# Altium project uADC_USB.PrjPcb
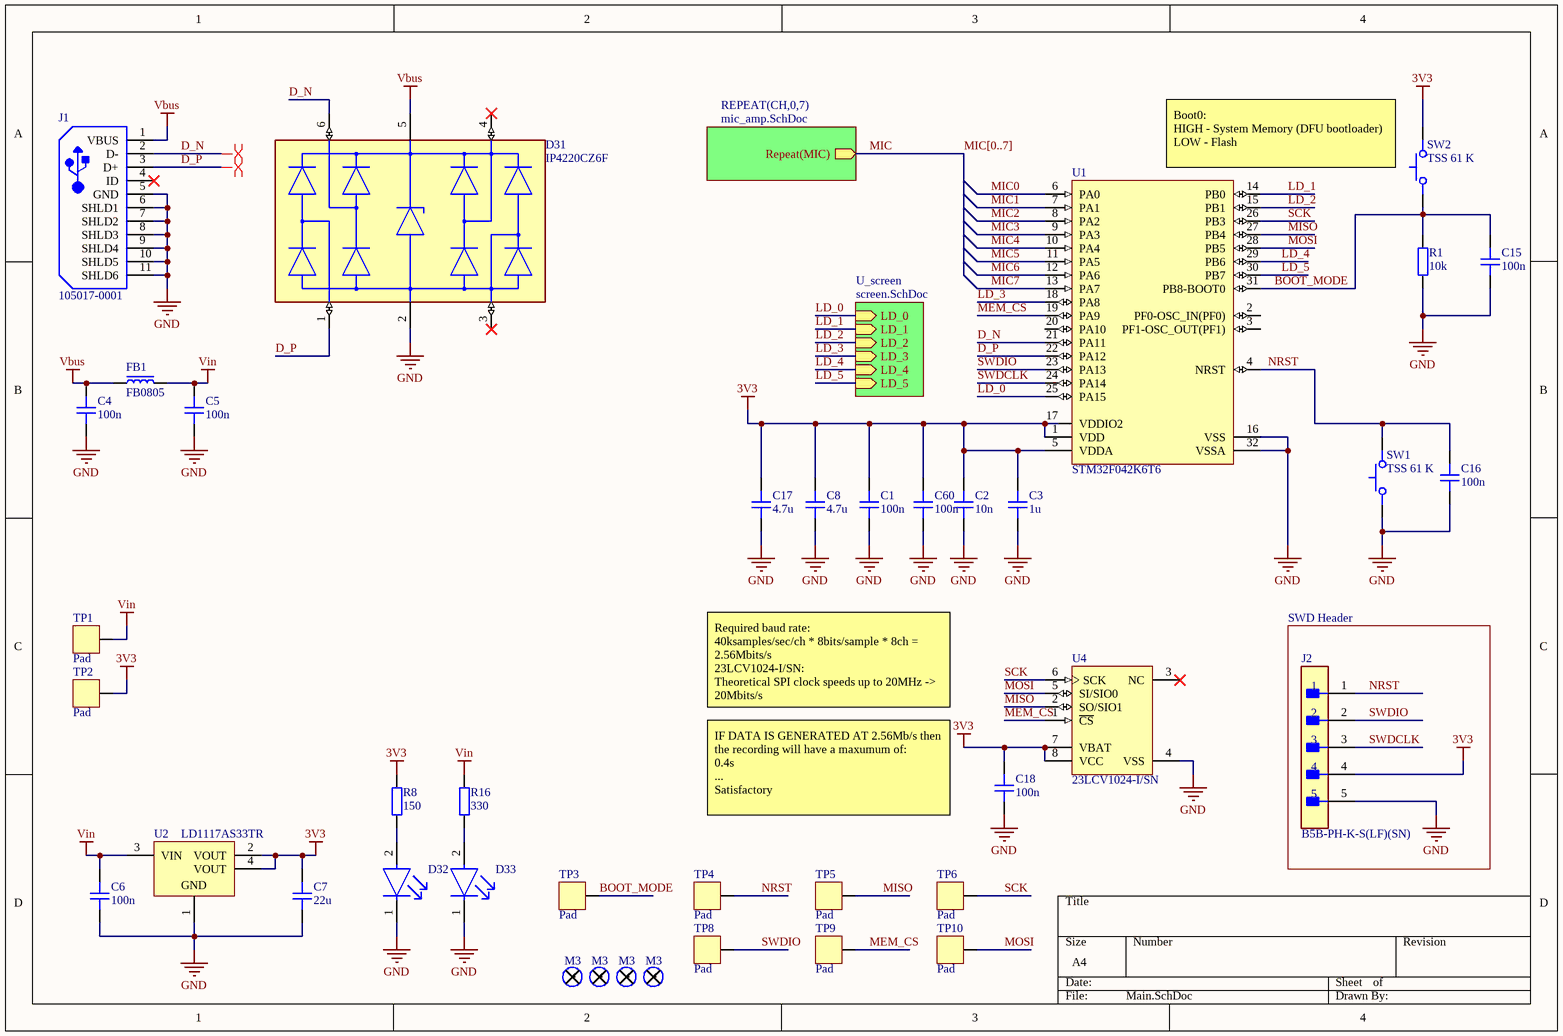
[diagram p0: Main.SchDoc]
3 sheets, 250 parts. Net scope: hierarchical (ports join the sheet entries above them; power ports are global).
Board file: uADC_PCBPcbDoc.PcbDoc
Sheets:
  Main.SchDoc
    U_screen = screen.SchDoc
    CH0 = mic_amp.SchDoc
    CH1 = mic_amp.SchDoc
    CH2 = mic_amp.SchDoc
    CH3 = mic_amp.SchDoc
    CH4 = mic_amp.SchDoc
    CH5 = mic_amp.SchDoc
    CH6 = mic_amp.SchDoc
    CH7 = mic_amp.SchDoc

## Sheet Main.SchDoc
size A4; SheetNumber: 1; SheetTotal: 3

### Parts
(Parts that share a designator on the sheet are numbered #1, #2 ... from top to bottom, then left to right.)
*1  M3Hole  [M3_Hole]  (value not drawn)  (no BOM)
*2  M3Hole  [M3_Hole]  (value not drawn)  (no BOM)
*3  M3Hole  [M3_Hole]  (value not drawn)  (no BOM)
*4  M3Hole  [M3_Hole]  (value not drawn)  (no BOM)
C1  100n  [CAP_0603]
C2  10n  [CAP_0603]
C3  1u  [CAP_0603]
C4  100n  [CAP_0603]
C5  100n  [CAP_0603]
C6  100n  [CAP_0603]
C7  22u  [CAP_0603]
C8  4.7u  [CAP_0603]
C15#1  100n  [CAP_0603]
C16#1  100n  [CAP_0603]
C17#1  4.7u  [CAP_0603]
C18#1  100n  [CAP_0603]
C60#1  100n  [CAP_0603]
D31  IP4220CZ6F  [FP-SOT457-IPC_A]
D32  598-8270-107F  [FP-598-8270-107F-MFG]  (value not drawn)
D33  598-8270-107F  [FP-598-8270-107F-MFG]  (value not drawn)
FB1  FB0805  [FB_0805]
J1  105017-0001  [USB-MICRO-B_V]
J2  B5B-PH-K-S(LF)(SN)  [FP-B5B-PH-K-S_LF_SN-MFG]
R1  10k  [RES_0603]
R8#1  150  [RES_0603]
R16#1  330  [RES_0603]
SW1  TSS 61 K  [Generic SMD Tactile switch]
SW2  TSS 61 K  [Generic SMD Tactile switch]
TP1  Pad  [PAD_SQ_2MM]  (no BOM)
TP2  Pad  [PAD_SQ_2MM]  (no BOM)
TP3  Pad  [PAD_SQ_2MM]  (no BOM)
TP4  Pad  [PAD_SQ_2MM]  (no BOM)
TP5  Pad  [PAD_SQ_2MM]  (no BOM)
TP6  Pad  [PAD_SQ_2MM]  (no BOM)
TP8  Pad  [PAD_SQ_2MM]  (no BOM)
TP9  Pad  [PAD_SQ_2MM]  (no BOM)
TP10#1  Pad  [PAD_SQ_2MM]  (no BOM)
U1  STM32F042K6T6  [STM-LQFP32_M]
U2  LD1117AS33TR  [SOT-223_M]
U4#1  23LCV1024-I/SN  [MCHP-SOIC-SN8_L]

### Blocks framed on the sheet
SWD Header: J2

### Sub-sheets
REPEAT(CH,0,7) = mic_amp.SchDoc: Repeat(MIC) (out)
U_screen = screen.SchDoc: LD_5 (in), LD_4 (in), LD_3 (in), LD_2 (in), LD_1 (in), LD_0 (in)

### Nets
3V3: C1.2 C2.2 C3.2 C7.2 C8.2 C17#1.2 C18#1.2 C60#1.2 J2.4 R8#1.2 SW2.2 TP2.1 U1.1(VDD) U1.5(VDDA) U1.17(VDDIO2) U2.2(VOUT) U2.4(VOUT) U4#1.7(VBAT) U4#1.8(VCC)
GND: C1.1 C2.1 C3.1 C4.1 C5.1 C6.1 C7.1 C8.1 C15#1.1 C16#1.1 C17#1.1 C18#1.1 C60#1.1 D31.2(GND) D32.1(C) D33.1(C) J1.5(GND) J1.6(SHLD1) J1.7(SHLD2) J1.8(SHLD3) J1.9(SHLD4) J1.10(SHLD5) J1.11(SHLD6) J2.5 R1.1 SW1.1 U1.16(VSS) U1.32(VSSA) U2.1(GND) U4#1.4(VSS)
Vbus: C4.2 D31.5(VP) FB1.1 J1.1(VBUS)
Vin: C5.2 C6.2 FB1.2 R16#1.2 TP1.1 U2.3(VIN)
BOOT_MODE: C15#1.2 R1.2 SW2.1 TP3.1 U1.31(PB8-BOOT0)
D_N: D31.6(I/O4) J1.2(D-) U1.21(PA11)
D_P: D31.1(I/O1) J1.3(D+) U1.22(PA12)
LD_0: U1.25(PA15) ; sheet U_screen/LD_0
LD_1: U1.14(PB0) ; sheet U_screen/LD_1
LD_2: U1.15(PB1) ; sheet U_screen/LD_2
LD_3: U1.18(PA8) ; sheet U_screen/LD_3
LD_4: U1.29(PB6) ; sheet U_screen/LD_4
LD_5: U1.30(PB7) ; sheet U_screen/LD_5
MEM_CS: TP9.1 U1.19(PA9) U4#1.1(~{CS})
MIC: sheet REPEAT(CH,0,7)/Repeat(MIC)
MIC0: U1.6(PA0)
MIC1: U1.7(PA1)
MIC2: U1.8(PA2)
MIC3: U1.9(PA3)
MIC4: U1.10(PA4)
MIC5: U1.11(PA5)
MIC6: U1.12(PA6)
MIC7: U1.13(PA7)
MISO: TP5.1 U1.27(PB4) U4#1.2(SO/SIO1)
MOSI: TP10#1.1 U1.28(PB5) U4#1.5(SI/SIO0)
NRST: C16#1.2 J2.1 SW1.2 TP4.1 U1.4(NRST)
SCK: TP6.1 U1.26(PB3) U4#1.6(SCK)
SWDCLK: J2.3 U1.24(PA14)
SWDIO: J2.2 TP8.1 U1.23(PA13)
NetD32_2: D32.2(A) R8#1.1
NetD33_2: D33.2(A) R16#1.1

Not connected (* = marked no-connect by the designer): *1 0; *2 0; *3 0; *4 0; D31 3(I/O2)* 4(I/O3)*; J1 4(ID)*; U1 2(PF0-OSC_IN(PF0)) 3(PF1-OSC_OUT(PF1)) 20(PA10); U4#1 3(NC)*

### Buses and harness runs
bus MIC[0..7]

### Layout directives
differential pair; rule Impedance Constraint [Min = 80.00    Max = 100.0    ]; rule Length Constraint [Min Length = 0mil    Max Length = 3937.008mil]: D_N
differential pair: D_P

### Notes on the sheet
- Boot0:
  HIGH - System Memory (DFU bootloader)
  LOW - Flash
- Required baud rate:
  40ksamples/sec/ch * 8bits/sample * 8ch = 2.56Mbits/s
  23LCV1024-I/SN:
  Theoretical SPI clock speeds up to 20MHz -> 20Mbits/s
- IF DATA IS GENERATED AT 2.56Mb/s then the recording will have a maxumum of:
  0.4s
  ...
  Satisfactory
- (in symbol M3Hole) M3

### Library data of the parts
C1-C8 C15#1 C16#1 C17#1 C18#1 C60#1 = CAP_0603: Capacitor SMD 0603, X7R, 10V; Manufacturer: *; Manufacturer Part Number: *; Distributor Link: *; LCSC: *; Rating: *; Dielectric: *
D31 = CMP-14432-000004-1: TVS DIODE 5.5VWM 6TSOP; RoHS Compliant: Yes
D32 D33 = CMP-15384-000006-1: SM LED 1206 ALINGAP G 7 REEL; Reverse Voltage: 5V; Viewing Angle: 140°; Power Dissipation: 60mW; Number of Elements: 1; Luminous Intensity: 20mcd; Color: Green; Lens Size: 1.6mm; Dominant Wavelength: 570nm; Test Current: 20mA; Forward Voltage: 2V; Lens Color: Colorless; Lens Transparency: Clear; Lens Style: Flat; Case/Package: 1206; RoHS Compliant: Yes; Number of Pins: 2; Packaging: Tape and Reel; Case Code (Metric): 3216; Lead Free: Lead Free; REACH SVHC: No SVHC; Height: 0.7mm; Depth: 1.6mm; Radiation Hardening: No; Length: 3.2mm; Wavelength: 570nm; Illumination Color: Green; Max Operating Temperature: 85°C; Min Operating Temperature: -30°C; Case Code (Imperial): 1206; Series: 598; Package Quantity: 3000; Mount: Surface Mount; Number of LEDs: 1; Forward Current: 20mA; Width: 1.6mm
FB1 = FB_0805: Ferrite Bead SMD 0805; Manufacturer: *; Manufacturer Part Number: *; Distributor Link: *; LCSC: *
J1 = CMP-2000-05827-1: Micro-USB B Receptacle, Right Angle, Bottom Mount, Surface Mount, with Solder Tabs, -30 to 85 degC, 5-Pin USB, RoHS, Tape and Reel; Manufacturer: Molex; Featured Product: Micro-USBConnectorsUSBConnectors; Other Names: WM1399DKR; Package Version: Rev. F, 12/2012; Number of Contacts: 5; Connector Type: USB-microB; Catalog Drawings: 1050170001; 3D Model: 105017-0001.stp; Mating Products: WM17145-ND-CABLEMICROUSBBTOSTDA1.0MWM17147-ND-CABLEMICROUSBBTOSTDA2.0MWM17146-ND-CABLEMICROUSBBTOSTDA1.5M; PCN Assembly/Origin: ResinSupplier21/Oct/2015; Voltage - Max: 30V; Online Catalog: Molex-MicroUSB; Manufacturer URL: http://www.molex.com/; Package Description: 5-Leads USB, Micro B, Body 7.5 x 5 mm, Pitch 0.65 mm; Datasheet URL: http://www.molex.com/elqNow/elqRedir.htm?ref=http://www.molex.com/webdocs/datasheets/pdf/en-us/1050170001_IO_CONNECTORS.pdf; Ingress Protection: -; Datasheet Version: 03/2016; Mounting Type: BoardCutout,SurfaceMount,RightAngle; Circuits: 5; Standard Package: 1; Package Reference: MICRO-B; Package URL: http://www.molex.com/pdm_docs/sd/1050170001_sd.pdf; Category: Connectors,Interconnects; Series: -; RoHS Information: 1050170001CertofCompliance; Features: Shielded,SolderRetention; Family: USB,DVI,HDMIConnectors; Specifications: -; Gender: Receptacle; Packaging: Digi-Reel®; Mounting Technology: SurfaceMount
J2 = CMP-2000-05908-2: CONN HEADER VERT 5POS 2MM; Voltage Rating (AC): 100V; Number of Positions: 5; Contact Resistance: 20mR; Insulation Resistance: 1MR; Current Rating: 2A; Gender: Male; Mated Stacking Heights: 8mm; Series: PH; Number of Poles: 5; Width: 4.5mm; Insulation Color: Natural; Fastening Type: Detent; Flammability Rating: UL94 V-0; Mount: Through Hole; Lead Free: Lead Free; Number of Rows: 1; REACH SVHC: No SVHC; Max Voltage Rating (AC): 100V; Contact Mating Length: 0.13inch; Contact Plating: Tin; Housing Material: Polyamide; Depth: 4.5mm; Contact Type: Male Pin; Voltage Rating: 100V; Color: Natural; Housing Color: White; Lead Pitch: 2mm; Number of Contacts: 5; Orientation: Straight; Packaging: Bulk; Contact Material: Brass; Pitch: 2mm; Insulation Material: Nylon; Connector Type: Header; Contact Finish - Mating: TIN; Termination: Solder; Number of Pins: 5; Length: 11.9mm; Contact Shape: Square; Max Current Rating: 2A; Working Voltage: 100V; Min Operating Temperature: -25°C; Max Operating Temperature: 85°C; Material: Polyamide; Height: 9.4mm
R1 R8#1 R16#1 = RES_0603: Resistor SMD 0603; Manufacturer: *; Manufacturer Part Number: *; Distributor Link: *; LCSC: *
SW1 SW2 = TSS 61 K: Keypad Switch, 1 Switches, SPST, Momentary, 0.05A, 12VDC, 1.47N, Solder Terminal, Surface Mount-straight; pin to pad: 1>1+2 2>3+4; Manufacturer: Knitter-Switch; Manufacturer Part Number: TSS61K; End Contact Plating: Silver; End Contact Material: Bronze; Actuator Type: STEM; Circuit Configuration: 1X1; Contact Current(DC)-Max: 50mA; Contact DC Max Rating R Load: .05A@12VDC; Contact Resistance: 0.1mR; Contact Voltage(DC)-Max: 12V; Dielectric Withstand Volts: 250VACV; Electrical Life: 200000Cycles; Insulation Resistance: 100MR; Number of Switches: 1; Solderability: REFLOW; Actuator Length: 0.031inch; Body Breadth: 6.2inch; Body Height: 3.5mm; Body Length or Diameter: 6.2mm; Supplier: TME; Supplier Part Number: TSS61K; RoHS: Yes; Category: Tactile Switches; Stock: 975; Mounting Technology: Surface Mount; Contact Material: Bronze; Center Contact Plating: Silver; Housing Material: Stainless Steel; Terminal Finish: Silver; Terminal Material: Brass; Min Operating Temperature: -40°C; Max Operating Temperature: 85°C; JESD-609 Code: e4; Operating Force-Max: 1.47N; Switch Action: MOMENTARY; Switch Function: SPST; Switch Type: Keypad; Termination: Solder; Reach SVHC Compliant: Yes; RoHS Compliant: Yes; ComponentLink1URL: https://datasheet.ciiva.com:443/pdfs/VipMasterIC/IC/KNSW/KNSW-S-A0003711307/KNSW-S-A0003711307-1.pdf?src-supplier=IHS+Markit; ComponentLink1Description: https://datasheet.ciiva.com:443/pdfs/VipMasterIC/IC/KNSW/KNSW-S-A0003711307/KNSW-S-A0003711307-1.pdf?src-supplier=IHS+Markit; ComponentLink2URL: http://www.knitter-switch.com/pdf_en/3_6_3%20TSS%20TS%20TMSE.pdf?src-supplier=Avnet; ComponentLink2Description: http://www.knitter-switch.com/pdf_en/3_6_3%20TSS%20TS%20TMSE.pdf?src-supplier=Avnet
TP1-TP6 TP8 TP9 TP10#1 = PAD_SQ_2MM: Test Point Square 2mm
U1 = CMP-0304-00114-2: ARM Cortex-M0 32-bit MCU, 32 KB Flash, 6 KB Internal RAM, 28 I/Os, 32-Pin LQFP, -40 to 85 degC, Tray; Manufacturer: STMicroelectronics; Operating Frequency(F) (Processor speed) (MHz): 48; Internal RAM Size (kB): 6; Supply Voltage(Vcc) min (V): 2; I/Os (High Current): 28; FLASH Size (Prog) (kB): 32; ComponentLink1Description: Manufacturer URL; Package Reference: LQFP32; ComponentLink2Description: Datasheet; ComponentLink1URL: http://www.st.com/; Core: ARM Cortex-M0; DatasheetVersion: Rev. 5; ComponentLink2URL: http://www.st.com/st-web-ui/static/active/en/resource/technical/document/datasheet/DM00105814.pdf; Packing: Tray; Package Description: 32-Pin Low Profile Quad Flat Package, 7 x 7 mm Body, 0.8 mm Pitch; PartNumber: STM32F042K6T6; Mounting Technology: Surface Mount
U2 = CMP-0244-00316-1: 1A, Low Drop Positive Voltage Regulator, 3.3V, 4-Pin SOT-223, Tape and Reel; ComponentLink1Description: Manufacturer URL; DatasheetVersion: 2/12/2011; PackageVersion: 2010; ComponentLink1URL: http://www.st.com; ComponentLink2Description: Datasheet; ComponentLink2URL: http://www.st.com/internet/com/TECHNICAL_RESOURCES/TECHNICAL_LITERATURE/DATASHEET/CD00002116.pdf; PackageDescription: 4-Pin SOT-223 Package, 6.5 x 3.5 mm Body, 2.3 mm Pitch, 7 mm Lead Span; PackageReference: SOT-223
U4#1 = CMP-0163-00037-1: 1024K bits SPI Serial SRAM with Battery Backup and SDI Interface, 2.5 to 5.5 V, 20 MHz, -40 to 85 degC, 8-pin SOIC (SN8), Tube; Manufacturer: Microchip; DatasheetVersion: Rev. A; ComponentLink3Description: Package Specification; PackageReference: SOIC-SN8; Mounting Technology: Surface Mount; PartNumber: 23LCV1024-I/SN; ComponentLink4Description: Product URL; ComponentLink2Description: Datasheet; ComponentLink3URL: http://www.microchip.com/stellent/groups/techpub_sg/documents/packagingspec/en012702.pdf; PackageDescription: 8-Lead Plastic Small Outline, 4.9 x 3.9 mm Body, 1.27 mm Pitch; ComponentLink1Description: Manufacturer URL; ComponentLink2URL: http://ww1.microchip.com/downloads/en/DeviceDoc/25156A.pdf; ComponentLink4URL: http://www.microchip.com/23LCV1024; ComponentLink1URL: http://www.microchip.com; PackageVersion: C04-057C

## Sheet screen.SchDoc
size A4; SheetNumber: 3; SheetTotal: 3
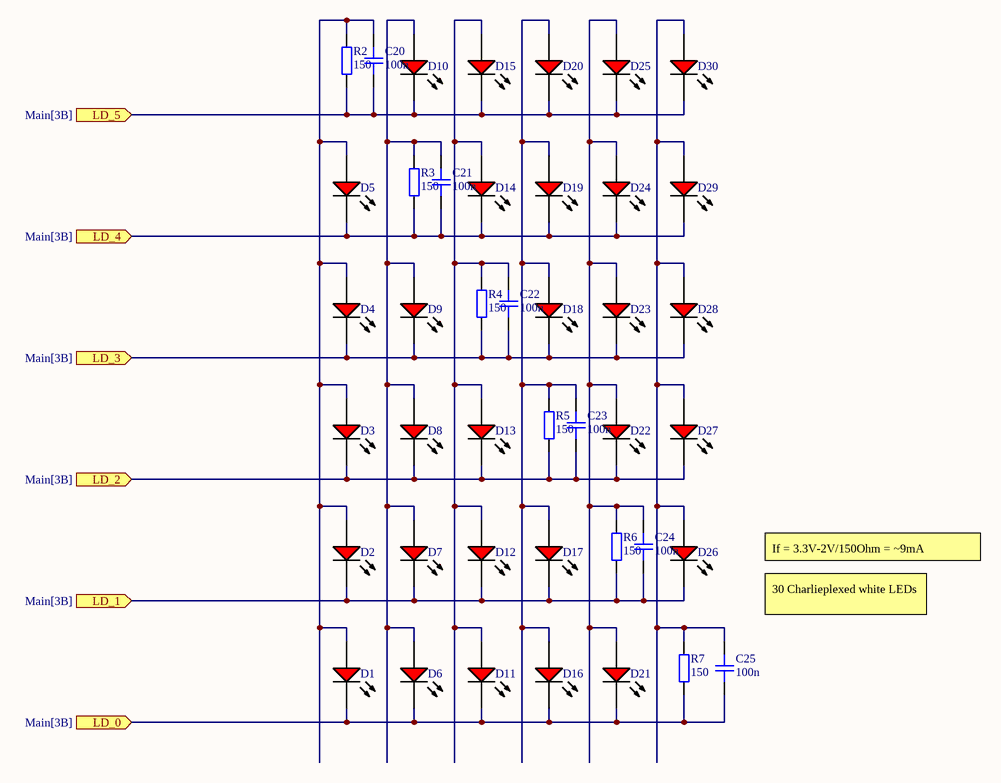
[diagram p1: screen.SchDoc]

### Parts
(Parts that share a designator on the sheet are numbered #1, #2 ... from top to bottom, then left to right.)
C20#1  100n  [CAP_0603]
C21#1  100n  [CAP_0603]
C22#1  100n  [CAP_0603]
C23#1  100n  [CAP_0603]
C24#1  100n  [CAP_0603]
C25#1  100n  [CAP_0603]
D1  SML-LX1206IC-TR  [LUMX-SML-LX1206IC_V]  (value not drawn)
D2  SML-LX1206IC-TR  [LUMX-SML-LX1206IC_V]  (value not drawn)
D3  SML-LX1206IC-TR  [LUMX-SML-LX1206IC_V]  (value not drawn)
D4  SML-LX1206IC-TR  [LUMX-SML-LX1206IC_V]  (value not drawn)
D5  SML-LX1206IC-TR  [LUMX-SML-LX1206IC_V]  (value not drawn)
D6  SML-LX1206IC-TR  [LUMX-SML-LX1206IC_V]  (value not drawn)
D7  SML-LX1206IC-TR  [LUMX-SML-LX1206IC_V]  (value not drawn)
D8  SML-LX1206IC-TR  [LUMX-SML-LX1206IC_V]  (value not drawn)
D9  SML-LX1206IC-TR  [LUMX-SML-LX1206IC_V]  (value not drawn)
D10  SML-LX1206IC-TR  [LUMX-SML-LX1206IC_V]  (value not drawn)
D11  SML-LX1206IC-TR  [LUMX-SML-LX1206IC_V]  (value not drawn)
D12  SML-LX1206IC-TR  [LUMX-SML-LX1206IC_V]  (value not drawn)
D13  SML-LX1206IC-TR  [LUMX-SML-LX1206IC_V]  (value not drawn)
D14  SML-LX1206IC-TR  [LUMX-SML-LX1206IC_V]  (value not drawn)
D15  SML-LX1206IC-TR  [LUMX-SML-LX1206IC_V]  (value not drawn)
D16  SML-LX1206IC-TR  [LUMX-SML-LX1206IC_V]  (value not drawn)
D17  SML-LX1206IC-TR  [LUMX-SML-LX1206IC_V]  (value not drawn)
D18  SML-LX1206IC-TR  [LUMX-SML-LX1206IC_V]  (value not drawn)
D19  SML-LX1206IC-TR  [LUMX-SML-LX1206IC_V]  (value not drawn)
D20  SML-LX1206IC-TR  [LUMX-SML-LX1206IC_V]  (value not drawn)
D21  SML-LX1206IC-TR  [LUMX-SML-LX1206IC_V]  (value not drawn)
D22  SML-LX1206IC-TR  [LUMX-SML-LX1206IC_V]  (value not drawn)
D23  SML-LX1206IC-TR  [LUMX-SML-LX1206IC_V]  (value not drawn)
D24  SML-LX1206IC-TR  [LUMX-SML-LX1206IC_V]  (value not drawn)
D25  SML-LX1206IC-TR  [LUMX-SML-LX1206IC_V]  (value not drawn)
D26  SML-LX1206IC-TR  [LUMX-SML-LX1206IC_V]  (value not drawn)
D27  SML-LX1206IC-TR  [LUMX-SML-LX1206IC_V]  (value not drawn)
D28  SML-LX1206IC-TR  [LUMX-SML-LX1206IC_V]  (value not drawn)
D29  SML-LX1206IC-TR  [LUMX-SML-LX1206IC_V]  (value not drawn)
D30  SML-LX1206IC-TR  [LUMX-SML-LX1206IC_V]  (value not drawn)
R2  150  [RES_0603]
R3  150  [RES_0603]
R4#1  150  [RES_0603]
R5#1  150  [RES_0603]
R6#1  150  [RES_0603]
R7#1  150  [RES_0603]

### Ports
LD_0 (in, see Main[3B]), LD_1 (in, see Main[3B]), LD_2 (in, see Main[3B]), LD_3 (in, see Main[3B]), LD_4 (in, see Main[3B]), LD_5 (in, see Main[3B])

### Nets
LD_0: C25#1.2 D1.2(K) D6.2(K) D11.2(K) D16.2(K) D21.2(K) R7#1.1 ; port LD_0
LD_1: C24#1.2 D2.2(K) D7.2(K) D12.2(K) D17.2(K) D26.2(K) R6#1.1 ; port LD_1
LD_2: C23#1.2 D3.2(K) D8.2(K) D13.2(K) D22.2(K) D27.2(K) R5#1.1 ; port LD_2
LD_3: C22#1.2 D4.2(K) D9.2(K) D18.2(K) D23.2(K) D28.2(K) R4#1.1 ; port LD_3
LD_4: C21#1.2 D5.2(K) D14.2(K) D19.2(K) D24.2(K) D29.2(K) R3.1 ; port LD_4
LD_5: C20#1.2 D10.2(K) D15.2(K) D20.2(K) D25.2(K) D30.2(K) R2.1 ; port LD_5
NetC20#1_1: C20#1.1 D1.1(A) D2.1(A) D3.1(A) D4.1(A) D5.1(A) R2.2
NetC21#1_1: C21#1.1 D6.1(A) D7.1(A) D8.1(A) D9.1(A) D10.1(A) R3.2
NetC22#1_1: C22#1.1 D11.1(A) D12.1(A) D13.1(A) D14.1(A) D15.1(A) R4#1.2
NetC23#1_1: C23#1.1 D16.1(A) D17.1(A) D18.1(A) D19.1(A) D20.1(A) R5#1.2
NetC24#1_1: C24#1.1 D21.1(A) D22.1(A) D23.1(A) D24.1(A) D25.1(A) R6#1.2
NetC25#1_1: C25#1.1 D26.1(A) D27.1(A) D28.1(A) D29.1(A) D30.1(A) R7#1.2

### Notes on the sheet
- If = 3.3V-2V/150Ohm = ~9mA
- 30 Charlieplexed white LEDs

### Library data of the parts
C20#1 C21#1 C22#1 C23#1 C24#1 C25#1 = CAP_0603: Capacitor SMD 0603, X7R, 10V; Manufacturer: *; Manufacturer Part Number: *; Distributor Link: *; LCSC: *; Rating: *; Dielectric: *
D1-D30 = CMP-2000-07123-1: LED Red, 65 mW, -40 to 85 degC, 2-Pin SMD, RoHS, Tape and Reel; Manufacturer: Lumex; LED Material: GaAsP; Peak Wavelength: 635nm; Number of LEDs: 1; Viewing Angle: 160; Reverse Voltage: 5(Min)V; Lens Appearance: ColorlessNonDiffused; Intensity: 6mcd; Type: Uni-Color; Pin_Count: 2; Lens Dimensions: 2x1.6x0.5mm; Mounting: SurfaceMount; ECCN: EAR99; RoHS: Unknown; Package Description: 2-Pin Surface Mount Device, Body 3.2 x 1.5 mm; Mounting Technology: SurfaceMount; Dominant Wavelength: N/A; Supplier_Package: SMD; Supplier Standard Pack: 3,000; Color: Red; Dimension: 3.2x1.6x1.1mm; HTS: 8541402000; Part No: SML-LX1206IC-TR; Family: SML-LX1206IC; Supplier: Lumex; Datasheet URL: http://www.lumex.com/content/files/ProductAttachment/SML-LX1206IC-TR.pdf; Package Reference: SML-LX1206IC; Manufacturer URL: http://www.lumexinstruments.com/; Operating Temperature: -25to85C; Packaging: TapeandReel; Datasheet Version: Rev. J, 08/2012
R2 R3 R4#1 R5#1 R6#1 R7#1 = RES_0603: Resistor SMD 0603; Manufacturer: *; Manufacturer Part Number: *; Distributor Link: *; LCSC: *

## Sheet mic_amp.SchDoc
size A4; SheetNumber: 2; SheetTotal: 3
Used 8 times, as channels CH0, CH1, CH2, CH3, CH4, CH5, CH6, CH7. Parts and nets are listed once, with the designators drawn on the sheet.
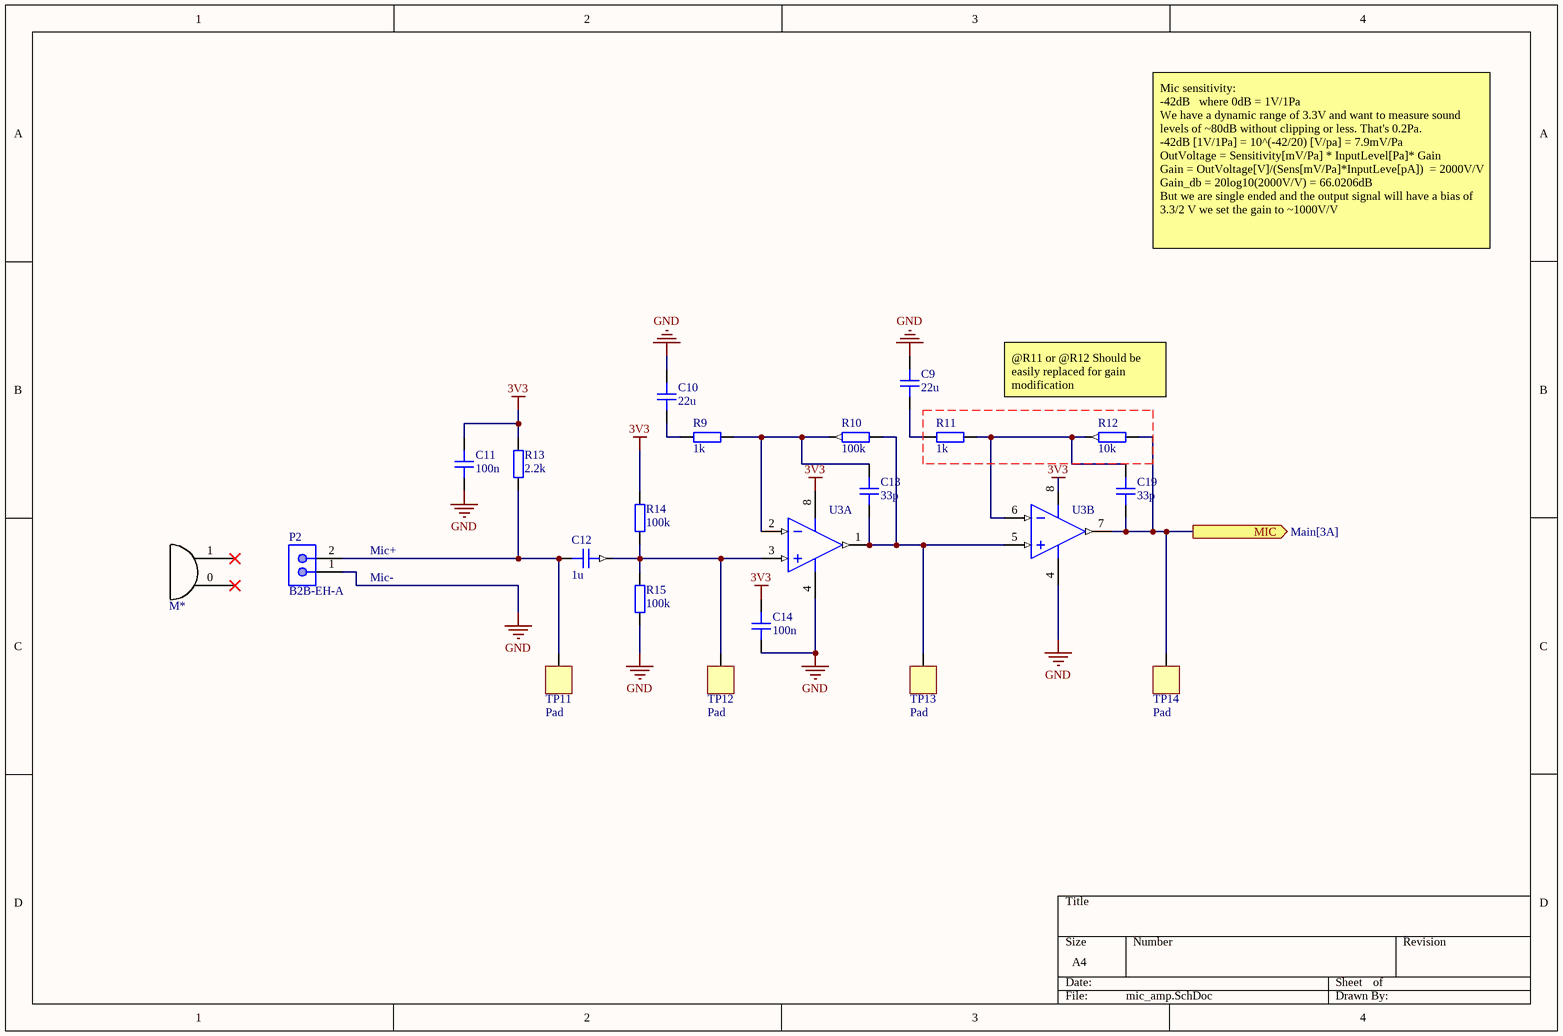
[diagram p2: mic_amp.SchDoc]

### Parts
C9  22u  [CAP_0603]
C10  22u  [CAP_0603]
C11  100n  [CAP_0603]
C12  1u  [CAP_0603]
C13  33p  [CAP_0603]
C14  100n  [CAP_0603]
C19  33p  [CAP_0603]
M*  LD-MC-0905P  (value not drawn)  (net tie)
P2  B2B-EH-A  [JST-B2B-EH-A_V]
R9  1k  [RES_0603]
R10  100k  [RES_0603]
R11  1k  [RES_0603]
R12  10k  [RES_0603]
R13  2.2k  [RES_0603]
R14  100k  [RES_0603]
R15  100k  [RES_0603]
TP11  Pad  [PAD_SQ_2MM]  (no BOM)
TP12  Pad  [PAD_SQ_2MM]  (no BOM)
TP13  Pad  [PAD_SQ_2MM]  (no BOM)
TP14  Pad  [PAD_SQ_2MM]  (no BOM)
U3  AD8602ARZ-REEL7  [ADI-R-8_M]  (value not drawn)  (parts A,B of 2)

### Ports
MIC (out, see Main[3A])

### Nets
3V3: C11.2 C14.2 R13.2 R14.2 U3.8(+V)
GND: C9.2 C10.2 C11.1 C14.1 P2.1 R15.1 U3.4(-V)
MIC: C19.1 R12.1 TP14.1 U3.7(OUT_B) ; port MIC
NetC9_1: C9.1 R11.2
NetC10_1: C10.1 R9.2
NetC12_1: C12.1 R14.1 R15.2 TP12.1 U3.3(+IN_A)
NetC12_2: C12.2 P2.2 R13.1 TP11.1
NetC13_1: C13.1 R10.1 TP13.1 U3.1(OUT_A) U3.5(+IN_B)
NetC13_2: C13.2 R9.1 R10.2 U3.2(-IN_A)
NetC19_2: C19.2 R11.1 R12.2 U3.6(-IN_B)

Not connected (* = marked no-connect by the designer): M* 0(6)* 1(7)*

### Channels
CH0: designators C9=C14 C10=C15#2 C11=C16#2 C12=C19 C13=C17#2 C14=C20#2 C19=C18#2 M*=M*_CH0 P2=CH0 R9=R4#2 R10=R5#2 R11=R6#2 R12=R7#2 R13=R8#2 R14=R9 R15=R10 TP11=TP10#2 TP12=TP11 TP13=TP13#1 TP14=TP13#2 U3=U4#2; ports MIC=MIC0
CH1: designators C9=C21#2 C10=C22#2 C11=C23#2 C12=C26 C13=C24#2 C14=C27 C19=C25#2 M*=M*_CH1 P2=CH1 R9=R11 R10=R12 R11=R13 R12=R14 R13=R15 R14=R16#2 R15=R17 TP11=TP14 TP12=TP15 TP13=TP16 TP14=TP17 U3=U5; ports MIC=MIC1
CH2: designators C9=C28 C10=C29 C11=C30 C12=C33 C13=C31 C14=C34 C19=C32 M*=M*_CH2 P2=CH2 R9=R18 R10=R19 R11=R20 R12=R21 R13=R22 R14=R23 R15=R24 TP11=TP18 TP12=TP19 TP13=TP20 TP14=TP21 U3=U6; ports MIC=MIC2
CH3: designators C9=C35 C10=C36 C11=C37 C12=C40 C13=C38 C14=C41 C19=C39 M*=M*_CH3 P2=CH3 R9=R25 R10=R26 R11=R27 R12=R28 R13=R29 R14=R30 R15=R31 TP11=TP22 TP12=TP23 TP13=TP24 TP14=TP25 U3=U7; ports MIC=MIC3
CH4: designators C9=C42 C10=C43 C11=C44 C12=C47 C13=C45 C14=C48 C19=C46 M*=M*_CH4 P2=CH4 R9=R32 R10=R33 R11=R34 R12=R35 R13=R36 R14=R37 R15=R38 TP11=TP26 TP12=TP27 TP13=TP28 TP14=TP29 U3=U8; ports MIC=MIC4
CH5: designators C9=C49 C10=C50 C11=C51 C12=C54 C13=C52 C14=C55 C19=C53 M*=M*_CH5 P2=CH5 R9=R39 R10=R40 R11=R41 R12=R42 R13=R43 R14=R44 R15=R45 TP11=TP30 TP12=TP31 TP13=TP32 TP14=TP33 U3=U9; ports MIC=MIC5
CH6: designators C9=C56 C10=C57 C11=C58 C12=C61 C13=C59 C14=C62 C19=C60#2 M*=M*_CH6 P2=CH6 R9=R46 R10=R47 R11=R48 R12=R49 R13=R50 R14=R51 R15=R52 TP11=TP34 TP12=TP35 TP13=TP36 TP14=TP37 U3=U10; ports MIC=MIC6
CH7: designators C9=C63 C10=C64 C11=C65 C12=C68 C13=C66 C14=C69 C19=C67 M*=M*_CH7 P2=CH7 R9=R53 R10=R54 R11=R55 R12=R56 R13=R57 R14=R58 R15=R59 TP11=TP38 TP12=TP39 TP13=TP40 TP14=TP41 U3=U11; ports MIC=MIC7

### Notes on the sheet
- Mic sensitivity:
  -42dB   where 0dB = 1V/1Pa
  We have a dynamic range of 3.3V and want to measure sound levels of ~80dB without clipping or less. That's 0.2Pa.
  -42dB [1V/1Pa] = 10^(-42/20) [V/pa] = 7.9mV/Pa
  OutVoltage = Sensitivity[mV/Pa] * InputLevel[Pa]* Gain
  Gain = OutVoltage[V]/(Sens[mV/Pa]*InputLeve[pA])  = 2000V/V
  Gain_db = 20log10(2000V/V) = 66.0206dB
  But we are single ended and the output signal will have a bias of 3.3/2 V we set the gain to ~1000V/V
- @R11 or @R12 Should be easily replaced for gain modification
- Mic+
- Mic-

### Library data of the parts
C9-C14 C19 = CAP_0603: Capacitor SMD 0603, X7R, 10V; Manufacturer: *; Manufacturer Part Number: *; Distributor Link: *; LCSC: *; Rating: *; Dielectric: *
M* = LD-MC-0905P: Microphone, electret
P2 = CMP-2000-05887-1: Male Header, Pitch 2.5 mm, 1 x 2 Position, Height 6 mm, Tail Length 3.2 mm, -25 to 85 degC, RoHS, Bulk; Manufacturer: JST; Other Names: 455-1014; Mating Products: 455-1000-ND-CONNHOUSINGEH2POS2.5MMCRIMP455-2933-ND-CONNRECEPTHR2POS2.5MMBLACK455-2934-ND-CONNRECEPTHR2POS2.5MMWHITE455-1044-ND-CONNRECEPTHR2POS2.5MMWHITE455-1057-ND-CONNRECEPTHR2POS2.5MMBLACK; Pitch: 0.098"(2.50mm); Connector Type: Header,Shrouded; Number of Positions: 2; Number of Positions Loaded: All; Manufacturer URL: http://www.jst.com/home2.html; Contact Type: MalePin; Package Description: Male Header, Pitch 2.5 mm, 1 x 2 Position, Height 6 mm, Tail Length 3.2 mm; Mounting Type: ThroughHole; Mounting Technology: ThroughHole; Number of Rows: 1; Features: -; Fastening Type: DetentLock; Contact Finish Thickness: -; Datasheet Version: 10/2002; Termination: Press-Fit; Datasheet URL: http://media.digikey.com/pdf/Data%20Sheets/JST%20PDFs/EH%20Series.pdf; Standard Package: 1,000; Category: Connectors,Interconnects; Family: RectangularConnectors-Headers,MalePins; Contact Finish: Tin-Lead; Packaging: Bulk; Color: Natural; Package Reference: B2B-EH-A; Row Spacing: -; Contact Mating Length: 0.130"(3.30mm); Series: EH
R9-R15 = RES_0603: Resistor SMD 0603; Manufacturer: *; Manufacturer Part Number: *; Distributor Link: *; LCSC: *
TP11-TP14 = PAD_SQ_2MM: Test Point Square 2mm
U3 = CMP-0384-00561-1: Double Channel Wide Bandwidth Operational Amplifier, 8.4 MHz BW, 6 V/us SR, Industrial, 8-pin SOIC (R-8), Reel; Manufacturer: Analog Devices; Generic Part Number: AD8602; Iq/Amp: 1.2mA; V Span Max: 6V; Input Offset Voltage: 500uV; Automotive Qualified: Yes; Slew Rate: 6V/us; Amplifiers Per Package: 2; Input Bias Current: 200fA; Small Signal Bandwidth: 8.4MHz; V Span Min: 2.7V; ComponentLink1Description: Manufacturer URL; PackageReference: R-8; ComponentLink2Description: Datasheet; Mounting Technology: Surface Mount; PackageDescription: 8-Pin Standard Small Outline Package, Body 3.9 x 4.9 mm, Pitch 1.27 mm; PartNumber: AD8602ARZ-REEL7; PackageVersion: 060506-A; ComponentLink3URL: http://www.analog.com/static/imported-files/packages/PKG_PDF/SOIC_Narrow%20(R)/R_8.pdf; ComponentLink2URL: http://www.analog.com/static/imported-files/data_sheets/AD8601_8602_8604.pdf; ComponentLink3Description: Package Specification; Code_JEDEC: MS-012-AA; ComponentLink1URL: http://www.analog.com/en/index.html; DatasheetVersion: Rev. G

## Nets that join several sheets
3V3: Main (19 pins), CH0 (5 pins), CH1 (5 pins), CH2 (5 pins), CH3 (5 pins), CH4 (5 pins), CH5 (5 pins), CH6 (5 pins), CH7 (5 pins)
GND: Main (30 pins), CH0 (7 pins), CH1 (7 pins), CH2 (7 pins), CH3 (7 pins), CH4 (7 pins), CH5 (7 pins), CH6 (7 pins), CH7 (7 pins)
LD_0: Main (U1.25), screen (7 pins)
LD_1: Main (U1.14), screen (7 pins)
LD_2: Main (U1.15), screen (7 pins)
LD_3: Main (U1.18), screen (7 pins)
LD_4: Main (U1.29), screen (7 pins)
LD_5: Main (U1.30), screen (7 pins)
MIC0: Main (U1.6), CH0 (C18#2.1 R7#2.1 TP13#2.1 U4#2.7)
MIC1: Main (U1.7), CH1 (C25#2.1 R14.1 TP17.1 U5.7)
MIC2: Main (U1.8), CH2 (C32.1 R21.1 TP21.1 U6.7)
MIC3: Main (U1.9), CH3 (C39.1 R28.1 TP25.1 U7.7)
MIC4: Main (U1.10), CH4 (C46.1 R35.1 TP29.1 U8.7)
MIC5: Main (U1.11), CH5 (C53.1 R42.1 TP33.1 U9.7)
MIC6: Main (U1.12), CH6 (C60#2.1 R49.1 TP37.1 U10.7)
MIC7: Main (U1.13), CH7 (C67.1 R56.1 TP41.1 U11.7)